# Altium schematic sheet EMI_Prot.SchDoc
size A4
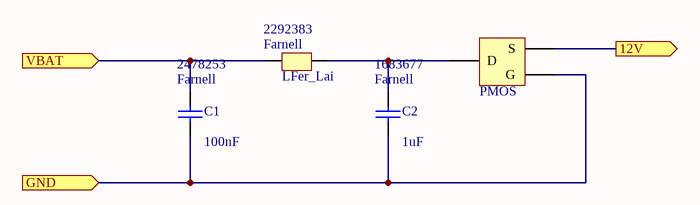
[diagram p0: EMI_Prot.SchDoc]

## Parts
C1  value 100nF  Supplier 1: Farnell  Supplier Part Number 1: 2478253  [CAP_0805]  (hidden comment: 100n)
C2  value 1uF  Supplier 1: Farnell  Supplier Part Number 1: 1683677  [CAP_0805]  (hidden comment: 1u)
LFer_Lai  Supplier 1: Farnell  Supplier Part Number 1: 2292383  [LFerrite_Laird]
PMOS  (no value)  [PMOS]

## Ports
12V (out), GND (in), VBAT (in)

## Nets
12V: PMOS.S ; port 12V
GND: C1.2 C2.2 PMOS.G ; port GND
VBAT: C1.1 LFer_Lai.1 ; port VBAT
NetC2_1: C2.1 LFer_Lai.2 PMOS.D

## Library data of the parts
C1 C2 = Cap Semi: Capacitor; Published: 8-Jun-2000; LatestRevisionDate: 29-May-2009; LatestRevisionNote: IPC-7351 Footprint Added.; PackageReference: C1206; Publisher: Altium Limited; PackageDescription: Chip Capacitor
LFer_Lai = LFerrite_Laird: Laird ferrite chip bead; HelpURL: http://www.farnell.com/datasheets/1685731.pdf?_ga=1.185171822.65109063.1469090403
PMOS = PMOS: P channel Mosfet; HelpURL: http://www.mouser.com/ds/2/115/DMP6180SK3-247239.pdf